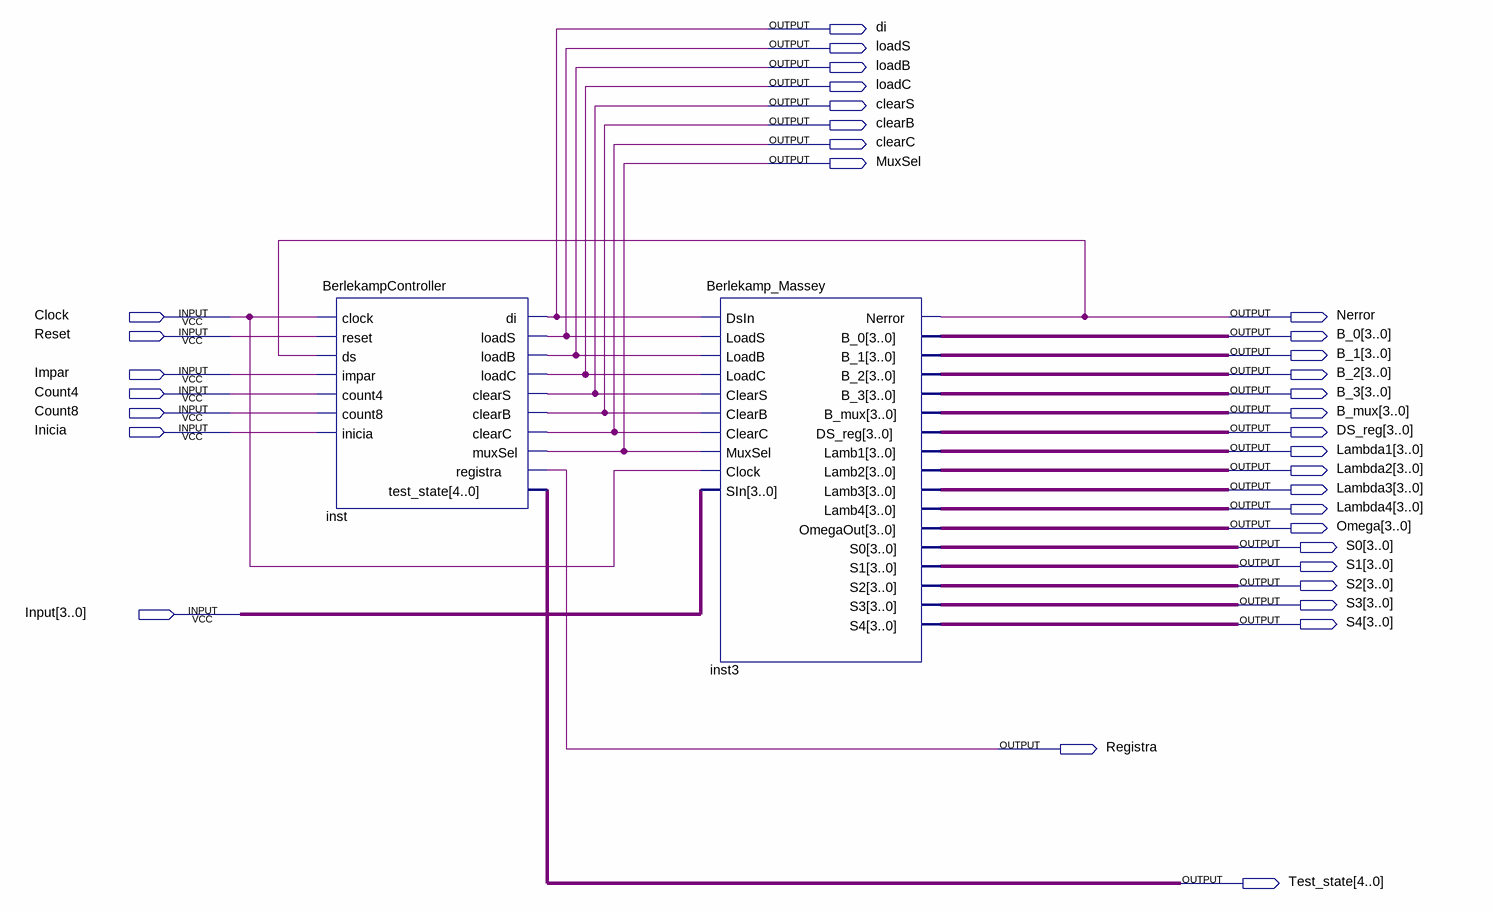
[diagram p0: schematic sheet]
// Quartus schematic BerleMas.bdf as structural Verilog: 2 symbols, 34 pins
module BerleMas (
  input  Clock,
  input  Reset,
  input  Impar,
  input  Count4,
  input  Count8,
  input  Inicia,
  input  [3:0] Input,
  output di,
  output loadS,
  output loadB,
  output loadC,
  output clearS,
  output clearB,
  output clearC,
  output MuxSel,
  output Nerror,
  output [3:0] B_0,
  output [3:0] B_1,
  output [3:0] B_2,
  output [3:0] B_3,
  output [3:0] B_mux,
  output [3:0] DS_reg,
  output [3:0] Lambda1,
  output [3:0] Lambda2,
  output [3:0] Lambda3,
  output [3:0] Lambda4,
  output [3:0] Omega,
  output [3:0] S0,
  output [3:0] S1,
  output [3:0] S2,
  output [3:0] S3,
  output [3:0] S4,
  output Registra,
  output [4:0] Test_state
);

  BerlekampController inst (
    .clock(Clock), .reset(Reset), .ds(Nerror), .impar(Impar), .count4(Count4), .count8(Count8),
    .inicia(Inicia), .di(di), .loadS(loadS), .loadB(loadB), .loadC(loadC), .clearS(clearS), .clearB(clearB),
    .clearC(clearC), .muxSel(MuxSel), .registra(Registra), .test_state(Test_state));
  Berlekamp_Massey inst3 (
    .DsIn(di), .LoadS(loadS), .LoadB(loadB), .LoadC(loadC), .ClearS(clearS), .ClearB(clearB),
    .ClearC(clearC), .MuxSel(MuxSel), .Clock(Clock), .SIn(Input), .Nerror(Nerror), .B_0(B_0), .B_1(B_1),
    .B_2(B_2), .B_3(B_3), .B_mux(B_mux), .DS_reg(DS_reg), .Lamb1(Lambda1), .Lamb2(Lambda2), .Lamb3(Lambda3),
    .Lamb4(Lambda4), .OmegaOut(Omega), .S0(S0), .S1(S1), .S2(S2), .S3(S3), .S4(S4));
endmodule
